# Altium schematic sheet SCH_SEGEMENTOS_HORA_1.SchDoc: TP Final - Reloj - Display Hora 1
size A4; Author: Luciano Lopez; CompanyName: UTN - FRBA; Revision: 1; SheetNumber: 5; SheetTotal: 10
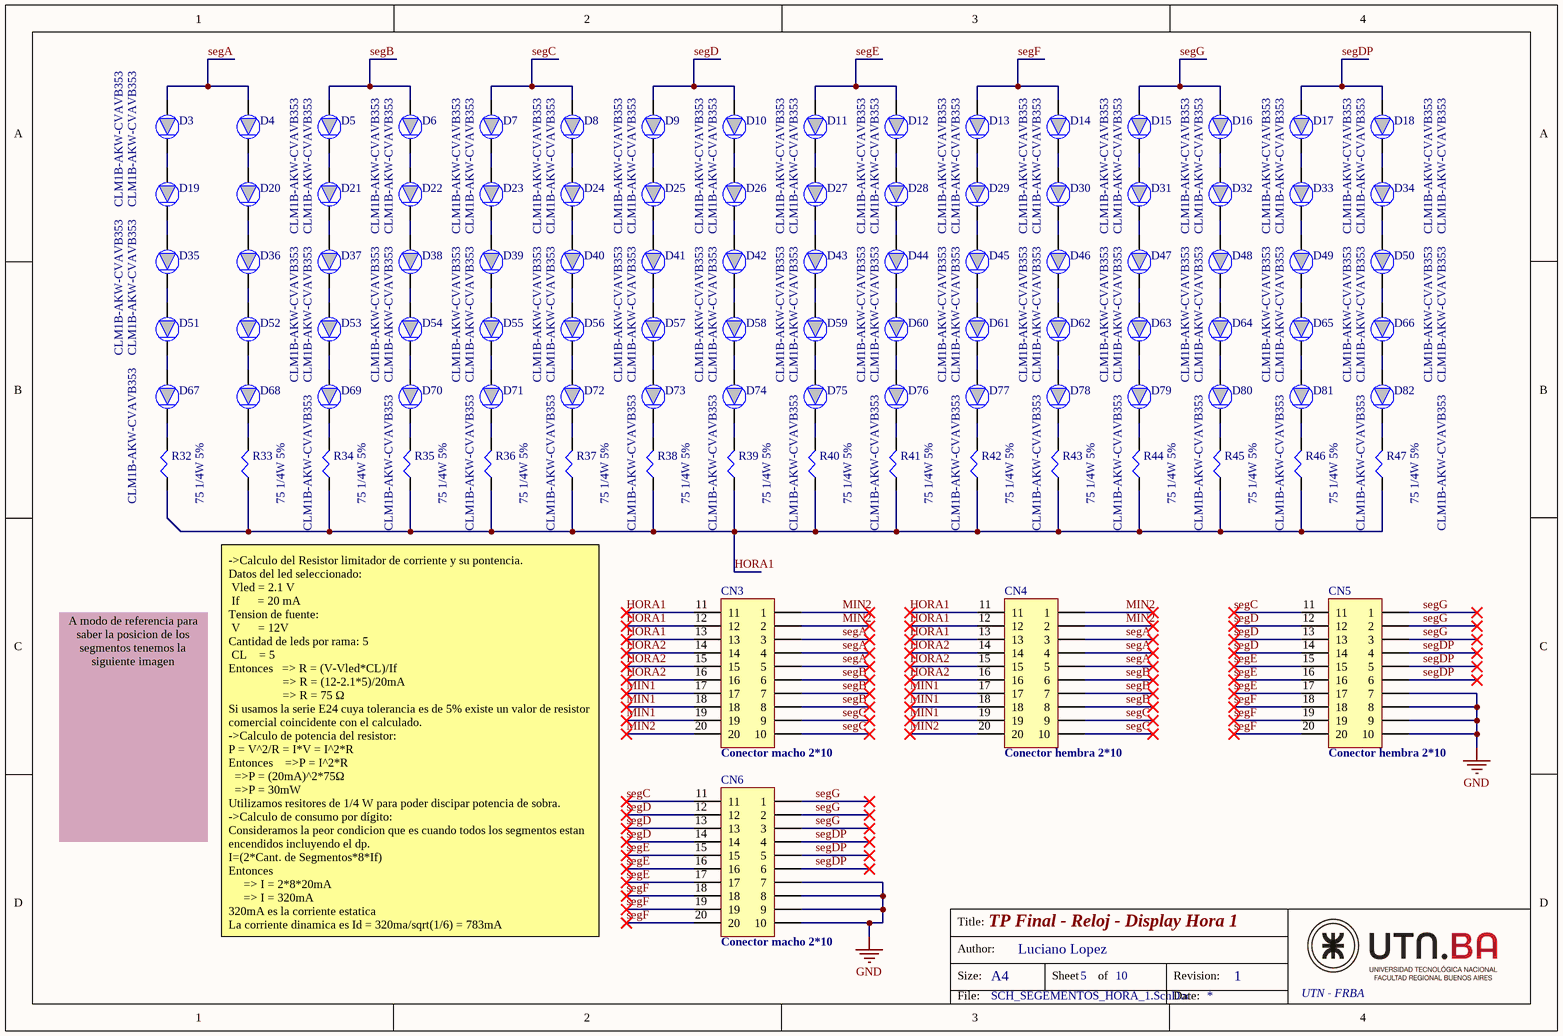
[diagram p0: SCH_SEGEMENTOS_HORA_1.SchDoc]

## Parts
CN3  Conector macho 2*10
CN4  Conector hembra 2*10
CN5  Conector hembra 2*10
CN6  Conector macho 2*10
D3  CLM1B-AKW-CVAVB353  [PLCC2_LED]
D4  CLM1B-AKW-CVAVB353  [PLCC2_LED]
D5  CLM1B-AKW-CVAVB353  [PLCC2_LED]
D6  CLM1B-AKW-CVAVB353  [PLCC2_LED]
D7  CLM1B-AKW-CVAVB353  [PLCC2_LED]
D8  CLM1B-AKW-CVAVB353  [PLCC2_LED]
D9  CLM1B-AKW-CVAVB353  [PLCC2_LED]
D10  CLM1B-AKW-CVAVB353  [PLCC2_LED]
D11  CLM1B-AKW-CVAVB353  [PLCC2_LED]
D12  CLM1B-AKW-CVAVB353  [PLCC2_LED]
D13  CLM1B-AKW-CVAVB353  [PLCC2_LED]
D14  CLM1B-AKW-CVAVB353  [PLCC2_LED]
D15  CLM1B-AKW-CVAVB353  [PLCC2_LED]
D16  CLM1B-AKW-CVAVB353  [PLCC2_LED]
D17  CLM1B-AKW-CVAVB353  [PLCC2_LED]
D18  CLM1B-AKW-CVAVB353  [PLCC2_LED]
D19  CLM1B-AKW-CVAVB353  [PLCC2_LED]
D20  CLM1B-AKW-CVAVB353  [PLCC2_LED]
D21  CLM1B-AKW-CVAVB353  [PLCC2_LED]
D22  CLM1B-AKW-CVAVB353  [PLCC2_LED]
D23  CLM1B-AKW-CVAVB353  [PLCC2_LED]
D24  CLM1B-AKW-CVAVB353  [PLCC2_LED]
D25  CLM1B-AKW-CVAVB353  [PLCC2_LED]
D26  CLM1B-AKW-CVAVB353  [PLCC2_LED]
D27  CLM1B-AKW-CVAVB353  [PLCC2_LED]
D28  CLM1B-AKW-CVAVB353  [PLCC2_LED]
D29  CLM1B-AKW-CVAVB353  [PLCC2_LED]
D30  CLM1B-AKW-CVAVB353  [PLCC2_LED]
D31  CLM1B-AKW-CVAVB353  [PLCC2_LED]
D32  CLM1B-AKW-CVAVB353  [PLCC2_LED]
D33  CLM1B-AKW-CVAVB353  [PLCC2_LED]
D34  CLM1B-AKW-CVAVB353  [PLCC2_LED]
D35  CLM1B-AKW-CVAVB353  [PLCC2_LED]
D36  CLM1B-AKW-CVAVB353  [PLCC2_LED]
D37  CLM1B-AKW-CVAVB353  [PLCC2_LED]
D38  CLM1B-AKW-CVAVB353  [PLCC2_LED]
D39  CLM1B-AKW-CVAVB353  [PLCC2_LED]
D40  CLM1B-AKW-CVAVB353  [PLCC2_LED]
D41  CLM1B-AKW-CVAVB353  [PLCC2_LED]
D42  CLM1B-AKW-CVAVB353  [PLCC2_LED]
D43  CLM1B-AKW-CVAVB353  [PLCC2_LED]
D44  CLM1B-AKW-CVAVB353  [PLCC2_LED]
D45  CLM1B-AKW-CVAVB353  [PLCC2_LED]
D46  CLM1B-AKW-CVAVB353  [PLCC2_LED]
D47  CLM1B-AKW-CVAVB353  [PLCC2_LED]
D48  CLM1B-AKW-CVAVB353  [PLCC2_LED]
D49  CLM1B-AKW-CVAVB353  [PLCC2_LED]
D50  CLM1B-AKW-CVAVB353  [PLCC2_LED]
D51  CLM1B-AKW-CVAVB353  [PLCC2_LED]
D52  CLM1B-AKW-CVAVB353  [PLCC2_LED]
D53  CLM1B-AKW-CVAVB353  [PLCC2_LED]
D54  CLM1B-AKW-CVAVB353  [PLCC2_LED]
D55  CLM1B-AKW-CVAVB353  [PLCC2_LED]
D56  CLM1B-AKW-CVAVB353  [PLCC2_LED]
D57  CLM1B-AKW-CVAVB353  [PLCC2_LED]
D58  CLM1B-AKW-CVAVB353  [PLCC2_LED]
D59  CLM1B-AKW-CVAVB353  [PLCC2_LED]
D60  CLM1B-AKW-CVAVB353  [PLCC2_LED]
D61  CLM1B-AKW-CVAVB353  [PLCC2_LED]
D62  CLM1B-AKW-CVAVB353  [PLCC2_LED]
D63  CLM1B-AKW-CVAVB353  [PLCC2_LED]
D64  CLM1B-AKW-CVAVB353  [PLCC2_LED]
D65  CLM1B-AKW-CVAVB353  [PLCC2_LED]
D66  CLM1B-AKW-CVAVB353  [PLCC2_LED]
D67  CLM1B-AKW-CVAVB353  [PLCC2_LED]
D68  CLM1B-AKW-CVAVB353  [PLCC2_LED]
D69  CLM1B-AKW-CVAVB353  [PLCC2_LED]
D70  CLM1B-AKW-CVAVB353  [PLCC2_LED]
D71  CLM1B-AKW-CVAVB353  [PLCC2_LED]
D72  CLM1B-AKW-CVAVB353  [PLCC2_LED]
D73  CLM1B-AKW-CVAVB353  [PLCC2_LED]
D74  CLM1B-AKW-CVAVB353  [PLCC2_LED]
D75  CLM1B-AKW-CVAVB353  [PLCC2_LED]
D76  CLM1B-AKW-CVAVB353  [PLCC2_LED]
D77  CLM1B-AKW-CVAVB353  [PLCC2_LED]
D78  CLM1B-AKW-CVAVB353  [PLCC2_LED]
D79  CLM1B-AKW-CVAVB353  [PLCC2_LED]
D80  CLM1B-AKW-CVAVB353  [PLCC2_LED]
D81  CLM1B-AKW-CVAVB353  [PLCC2_LED]
D82  CLM1B-AKW-CVAVB353  [PLCC2_LED]
R32  75 1/4W 5%  [R_0805]
R33  75 1/4W 5%  [R_0805]
R34  75 1/4W 5%  [R_0805]
R35  75 1/4W 5%  [R_0805]
R36  75 1/4W 5%  [R_0805]
R37  75 1/4W 5%  [R_0805]
R38  75 1/4W 5%  [R_0805]
R39  75 1/4W 5%  [R_0805]
R40  75 1/4W 5%  [R_0805]
R41  75 1/4W 5%  [R_0805]
R42  75 1/4W 5%  [R_0805]
R43  75 1/4W 5%  [R_0805]
R44  75 1/4W 5%  [R_0805]
R45  75 1/4W 5%  [R_0805]
R46  75 1/4W 5%  [R_0805]
R47  75 1/4W 5%  [R_0805]

## Nets
GND: CN5.7 CN5.8 CN5.9 CN5.10 CN6.7 CN6.8 CN6.9 CN6.10
HORA1: CN3.11 CN3.12 CN3.13 CN4.11 CN4.12 CN4.13 R32.47 R33.47 R34.47 R35.47 R36.47 R37.47 R38.47 R39.47 R40.47 R41.47 R42.47 R43.47 R44.47 R45.47 R46.47 R47.47
HORA2: CN3.14 CN3.15 CN3.16 CN4.14 CN4.15 CN4.16
MIN1: CN3.17 CN3.18 CN3.19 CN4.17 CN4.18 CN4.19
MIN2: CN3.1 CN3.2 CN3.20 CN4.1 CN4.2 CN4.20
segA: CN3.3 CN3.4 CN3.5 CN4.3 CN4.4 CN4.5 D3.12 D4.12
segB: CN3.6 CN3.7 CN3.8 CN4.6 CN4.7 CN4.8 D5.12 D6.12
segC: CN3.9 CN3.10 CN4.9 CN4.10 CN5.11 CN6.11 D7.12 D8.12
segD: CN5.12 CN5.13 CN5.14 CN6.12 CN6.13 CN6.14 D9.12 D10.12
segDP: CN5.4 CN5.5 CN5.6 CN6.4 CN6.5 CN6.6 D17.12 D18.12
segE: CN5.15 CN5.16 CN5.17 CN6.15 CN6.16 CN6.17 D11.12 D12.12
segF: CN5.18 CN5.19 CN5.20 CN6.18 CN6.19 CN6.20 D13.12 D14.12
segG: CN5.1 CN5.2 CN5.3 CN6.1 CN6.2 CN6.3 D15.12 D16.12
NetD3_11: D3.11 D19.12
NetD4_11: D4.11 D20.12
NetD5_11: D5.11 D21.12
NetD6_11: D6.11 D22.12
NetD7_11: D7.11 D23.12
NetD8_11: D8.11 D24.12
NetD9_11: D9.11 D25.12
NetD10_11: D10.11 D26.12
NetD11_11: D11.11 D27.12
NetD12_11: D12.11 D28.12
NetD13_11: D13.11 D29.12
NetD14_11: D14.11 D30.12
NetD15_11: D15.11 D31.12
NetD16_11: D16.11 D32.12
NetD17_11: D17.11 D33.12
NetD18_11: D18.11 D34.12
NetD19_11: D19.11 D35.12
NetD20_11: D20.11 D36.12
NetD21_11: D21.11 D37.12
NetD22_11: D22.11 D38.12
NetD23_11: D23.11 D39.12
NetD24_11: D24.11 D40.12
NetD25_11: D25.11 D41.12
NetD26_11: D26.11 D42.12
NetD27_11: D27.11 D43.12
NetD28_11: D28.11 D44.12
NetD29_11: D29.11 D45.12
NetD30_11: D30.11 D46.12
NetD31_11: D31.11 D47.12
NetD32_11: D32.11 D48.12
NetD33_11: D33.11 D49.12
NetD34_11: D34.11 D50.12
NetD35_11: D35.11 D51.12
NetD36_11: D36.11 D52.12
NetD37_11: D37.11 D53.12
NetD38_11: D38.11 D54.12
NetD39_11: D39.11 D55.12
NetD40_11: D40.11 D56.12
NetD41_11: D41.11 D57.12
NetD42_11: D42.11 D58.12
NetD43_11: D43.11 D59.12
NetD44_11: D44.11 D60.12
NetD45_11: D45.11 D61.12
NetD46_11: D46.11 D62.12
NetD47_11: D47.11 D63.12
NetD48_11: D48.11 D64.12
NetD49_11: D49.11 D65.12
NetD50_11: D50.11 D66.12
NetD51_11: D51.11 D67.12
NetD52_11: D52.11 D68.12
NetD53_11: D53.11 D69.12
NetD54_11: D54.11 D70.12
NetD55_11: D55.11 D71.12
NetD56_11: D56.11 D72.12
NetD57_11: D57.11 D73.12
NetD58_11: D58.11 D74.12
NetD59_11: D59.11 D75.12
NetD60_11: D60.11 D76.12
NetD61_11: D61.11 D77.12
NetD62_11: D62.11 D78.12
NetD63_11: D63.11 D79.12
NetD64_11: D64.11 D80.12
NetD65_11: D65.11 D81.12
NetD66_11: D66.11 D82.12
NetD67_11: D67.11 R32.48
NetD68_11: D68.11 R33.48
NetD69_11: D69.11 R34.48
NetD70_11: D70.11 R35.48
NetD71_11: D71.11 R36.48
NetD72_11: D72.11 R37.48
NetD73_11: D73.11 R38.48
NetD74_11: D74.11 R39.48
NetD75_11: D75.11 R40.48
NetD76_11: D76.11 R41.48
NetD77_11: D77.11 R42.48
NetD78_11: D78.11 R43.48
NetD79_11: D79.11 R44.48
NetD80_11: D80.11 R45.48
NetD81_11: D81.11 R46.48
NetD82_11: D82.11 R47.48

## Notes on the sheet
- A modo de referencia para saber la posicion de los segmentos tenemos la siguiente imagen
- ->Calculo del Resistor limitador de corriente y su pontencia.
  Datos del led seleccionado:
  Vled = 2.1 V
  If      = 20 mA
  Tension de fuente:
  V      = 12V
  Cantidad de leds por rama: 5
  CL    = 5
  Entonces   => R = (V-Vled*CL)/If
  => R = (12-2.1*5)/20mA
  => R = 75 Ω
  Si usamos la serie E24 cuya tolerancia es de 5% existe un valor de resistor comercial coincidente con el calculado.
  ->Calculo de potencia del resistor:
  P = V^2/R = I*V = I^2*R
  Entonces    =>P = I^2*R
  =>P = (20mA)^2*75Ω
  =>P = 30mW
  Utilizamos resitores de 1/4 W para poder discipar potencia de sobra.
  ->Calculo de consumo por dígito:
  Consideramos la peor condicion que es cuando todos los segmentos estan encendidos incluyendo el dp.
  I=(2*Cant. de Segmentos*8*If)
  Entonces
  => I = 2*8*20mA
  => I = 320mA
  320mA es la corriente estatica
  La corriente dinamica es Id = 320ma/sqrt(1/6) = 783mA
- Title:
- Size:
- Author:
- A4
- Sheet
- of
- Revision:
- File:
- Date:

## Library data of the parts
CN3-CN6 = CONN_2x10P: Connector Generic 10 Vias
D3-D82 = LED_DIODE
R32-R47 = Resistor